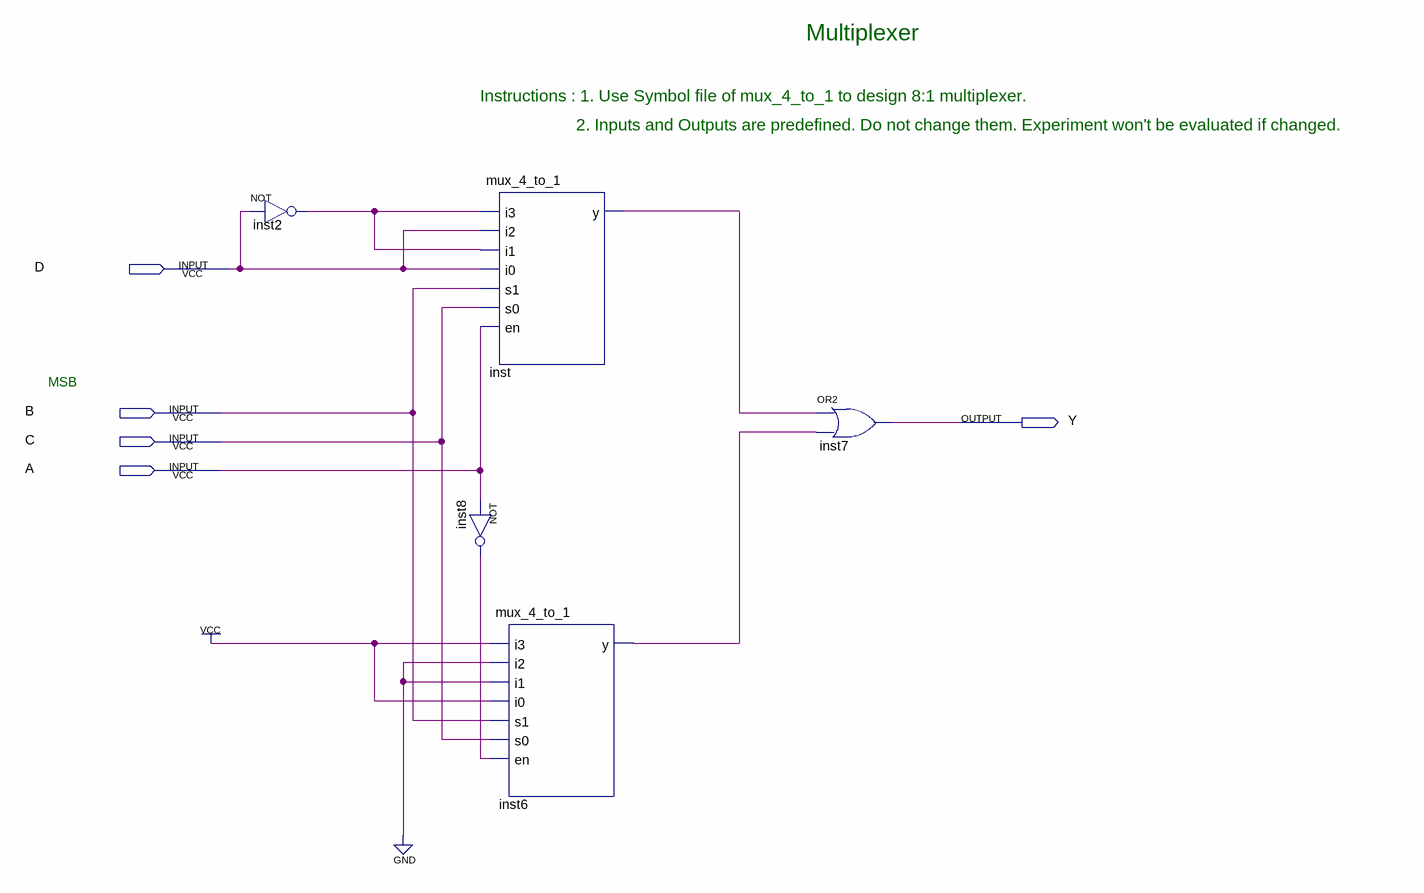
[diagram p0: schematic sheet]
// Quartus schematic mux_8_to_1.bdf as structural Verilog: 5 symbols, 5 pins
module mux_8_to_1 (
  input  D,
  input  B,
  input  C,
  input  A,
  output Y
);

  wire inst2_out, inst6_y, inst8_out, inst_y;

  not inst2 (inst2_out, D);
  mux_4_to_1 inst (.i3(inst2_out), .i2(D), .i1(inst2_out), .i0(D), .s1(B), .s0(C), .en(A), .y(inst_y));
  not inst8 (inst8_out, A);
  mux_4_to_1 inst6 (.i3(1'b1), .i2(1'b0), .i1(1'b0), .i0(1'b1), .s1(B), .s0(C), .en(inst8_out), .y(inst6_y));
  or inst7 (Y, inst_y, inst6_y);

  // Notes on the sheet:
  //   Multiplexer
  //   Instructions : 1. Use Symbol file of mux_4_to_1 to design 8:1 multiplexer. 
  //   2. Inputs and Outputs are predefined. Do not change them. Experiment won't be evaluated if changed.
  //   MSB
endmodule
